# Altium schematic sheet Sheet2.SchDoc
size A; SheetNumber: 1; SheetTotal: 1
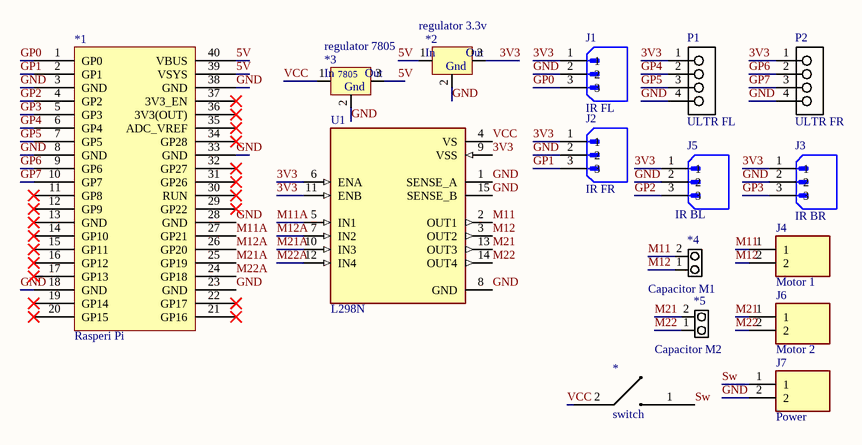
[diagram p0: Sheet2.SchDoc]

## Parts
*  switch  [switch]
*1  Rasperi Pi  [Rasperi Pi]
*2  regulator 3.3v  [Regulator 3.3V]
*3  regulator 7805  [Regulator 7805]
*4  Capacitor M1  [Capacitor]
*5  Capacitor M2  [Capacitor]
J1  IR FL  [3pin jst]
J2  IR FR  [3pin jst]
J3  IR BR  [3pin jst]
J4  Motor 1  [Power Terminal block]
J5  IR BL  [3pin jst]
J6  Motor 2  [Power Terminal block]
J7  Power  [Power Terminal block]
P1  ULTR FL  [4pin jst]
P2  ULTR FR  [4pin jst]
U1  L298N  [L298N]

## Nets
3V3: *2.3(Output) J1.1 J2.1 J3.1 J5.1 P1.1 P2.1 U1.6(ENA) U1.9(VSS) U1.11(ENB)
5V: *1.39(VSYS) *1.40(VBUS) *2.1(input) *3.3(Output)
GND: *1.3(GND) *1.8(GND) *1.18(GND) *1.23(GND) *1.28(GND) *1.33(GND) *1.38(GND) *2.2(Ground) *3.2(Ground) J1.2 J2.2 J3.2 J5.2 J7.2 P1.4 P2.4 U1.1(SENSE_A) U1.8(GND) U1.15(SENSE_B)
GP0: *1.1(GP0) J1.3
GP1: *1.2(GP1) J2.3
GP2: *1.4(GP2) J5.3
GP3: *1.5(GP3) J3.3
GP4: *1.6(GP4) P1.2
GP5: *1.7(GP5) P1.3
GP6: *1.9(GP6) P2.2
GP7: *1.10(GP7) P2.3
M11: *4.2 J4.1 U1.2(OUT1)
M11A: *1.27(GP21) U1.5(IN1)
M12: *4.1 J4.2 U1.3(OUT2)
M12A: *1.26(GP20) U1.7(IN2)
M21: *5.2 J6.1 U1.13(OUT3)
M21A: *1.25(GP19) U1.10(IN3)
M22: *5.1 J6.2 U1.14(OUT4)
M22A: *1.24(GP18) U1.12(IN4)
Sw: *.1 J7.1
VCC: *.2 *3.1(input) U1.4(VS)

Not connected (* = marked no-connect by the designer): *1 11(GP8)* 12(GP9)* 13(GND)* 14(GP10)* 15(GP11)* 16(GP12)* 17(GP13)* 19(GP14)* 20(GP15)* 21(GP16)* 22(GP17)* 29(GP22)* 30(RUN)* 31(GP26)* 32(GP27)* 34(GP28)* 35(ADC_VREF)* 36(3V3(OUT))* 37(3V3_EN)*

## Notes on the sheet
- (in symbol regulator 3.3v) In; Out; Gnd
- (in symbol regulator 7805) In; 7805; Out; Gnd

## Library data of the parts
*4 *5 = Capacitor
J1-J3 J5 = 3pin jst: Connector Header Through Hole 3 position 0.098 (2.50mm); MP: B3B-XH-A(LF)(SN); MF: JST Sales; Check_prices: https://www.snapeda.com/parts/B3B-XH-A(LF)(SN)/JST+Sales+America+Inc./view-part/?ref=eda; Value: *; Availability: In Stock; Price: None; Package: None; SnapEDA_Link: https://www.snapeda.com/parts/B3B-XH-A(LF)(SN)/JST+Sales+America+Inc./view-part/?ref=snap; Purchase-URL: https://pricing.snapeda.com/search/part/B3B-XH-A(LF)(SN)/?ref=eda
J4 J6 J7 = Power Terminal block: Conn Terminal Block 2 POS 9.53mm Solder ST Thru-Hole 25A/Contact; MF: TE Connectivity / AMP; MP: 4-1437652-6; SnapEDA_Link: https://www.snapeda.com/parts/4-1437652-6/TE%20Connectivity%20/%20AMP/view-part/2382815/?ref=snap; Availability: Unavailable; Price: None; EU_RoHS_Compliance: Compliant; Value: *; Package: None; TE_purchase_URL: https://www.te.com/usa-en/product-4-1437652-6.html?te_bu=Cor&te_type=disp&te_campaign=seda_glo_cor-seda-global-disp-prtnr-fy19-seda-model-bom-cta_sma-317_1&elqCampaignId=32493
P1 P2 = 4pin jst: Connector Header Through Hole 4 position 0.079 (2.00mm); MP: B4B-PH-K; MF: JST; SnapEDA_Link: https://www.snapeda.com/parts/B4B-PH-K/JST/view-part/?ref=snap; Package: None; Check_prices: https://www.snapeda.com/parts/B4B-PH-K/JST/view-part/?ref=eda; Purchase-URL: https://pricing.snapeda.com/search/part/B4B-PH-K/?ref=eda; Price: None; Value: *; Availability: In Stock
U1 = L298N: Dual Full Bridge Motor Driver 15-Pin(15+Tab) MULTIWATT V Tube; MP: L298N; Availability: Unavailable; Package: None; Value: *; Price: None